# EAGLE design rev_A (EAGLE 7.7.0)
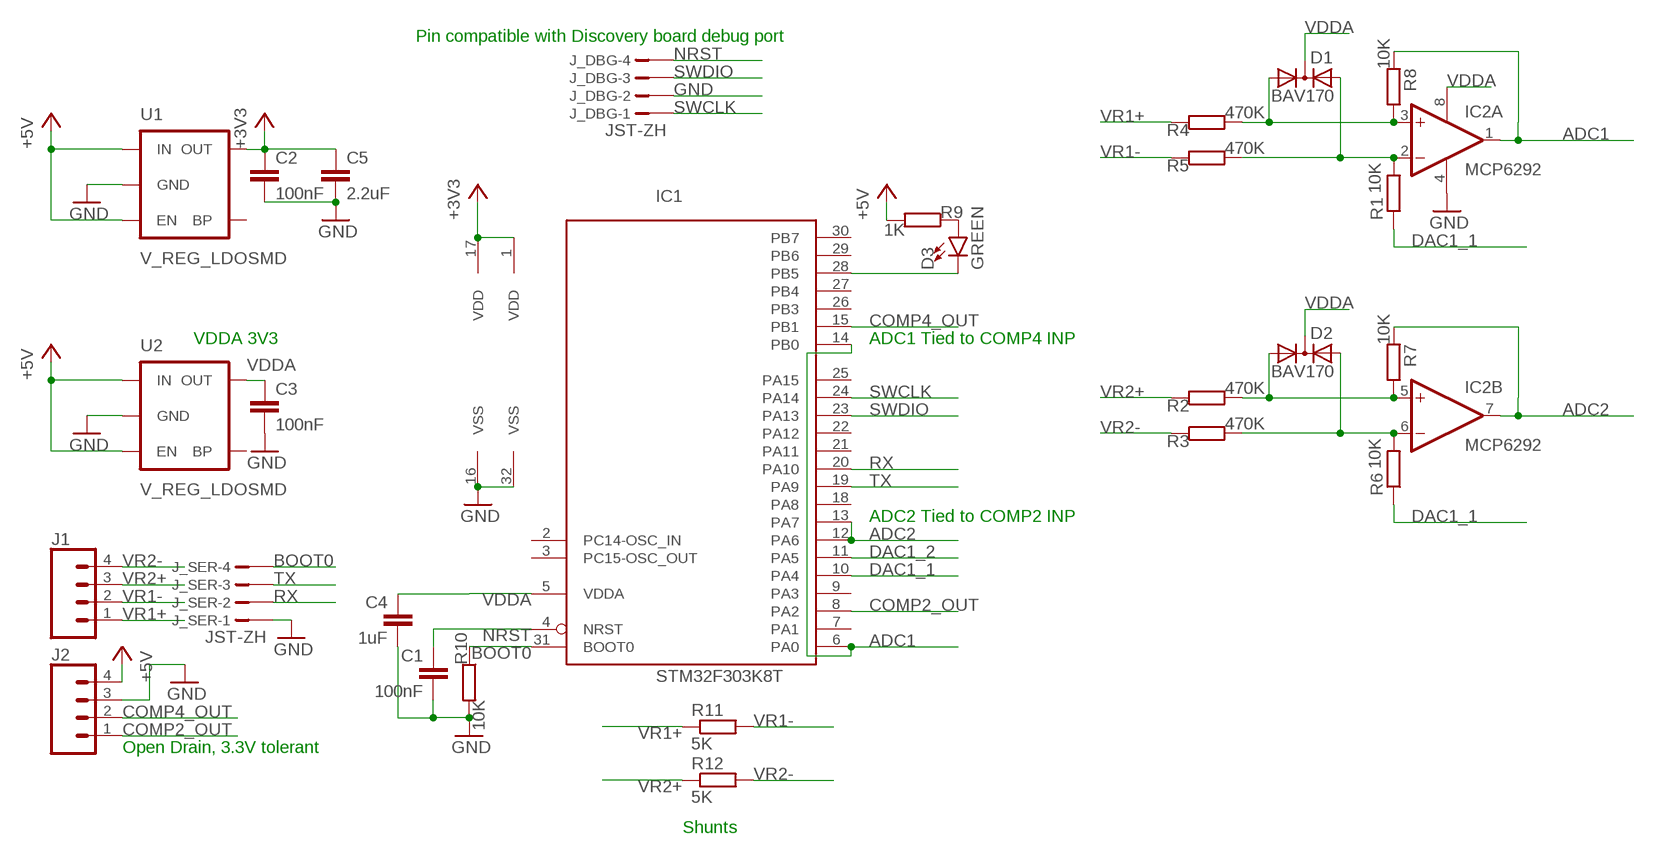
[diagram p0: schematic, sheet 1]

## Parts
C1  100nF  C-EUC0603  [C0603]
C2  100nF  C-EUC0603  [C0603]
C3  100nF  C-EUC0603  [C0603]
C4  1uF  C-EUC0603  [C0603]
C5  2.2uF  C-EUC0603  [C0603]
D1  BAV170  DIODE-2AC|CASOT23  [SOT23]
D2  BAV170  DIODE-2AC|CASOT23  [SOT23]
D3  GREEN  LED-GREEN0603  [LED-0603]
IC1  STM32F303K8T  STM32L051K6T  [LQFP32]
IC2  MCP6292  MCP602SN  [SO08]
J1  CONN_04LOCK  [1X04_LOCK]
J2  CONN_04LOCK  [1X04_LOCK]
J_DBG  JST-ZH  B4B-ZR  [B4B-ZR]
J_SER  JST-ZH  B4B-ZR  [B4B-ZR]
R1  10K  R-EU_R0603  [R0603]
R2  470K  R-EU_R0603  [R0603]
R3  470K  R-EU_R0603  [R0603]
R4  470K  R-EU_R0603  [R0603]
R5  470K  R-EU_R0603  [R0603]
R6  10K  R-EU_R0603  [R0603]
R7  10K  R-EU_R0603  [R0603]
R8  10K  R-EU_R0603  [R0603]
R9  1K  R-EU_R0603  [R0603]
R10  10K  R-EU_R0603  [R0603]
R11  5K  R-EU_0411/12  [0411/12]
R12  5K  R-EU_0411/12  [0411/12]
U1  V_REG_LDOSMD  [SOT23-5]
U2  V_REG_LDOSMD  [SOT23-5]

## Nets
+3V3: C2.1 C5.1 IC1.1(VDD) IC1.17(VDD) U1.5(OUT)
+5V: J2.4 R9.2 U1.1(IN) U1.3(EN) U2.1(IN) U2.3(EN)
ADC1: IC1.6(PA0) IC1.14(PB0) IC2.1(A:OUT) R8.2
ADC2: IC1.12(PA6) IC1.13(PA7) IC2.7(B:OUT) R7.2
BOOT0: IC1.31(BOOT0) J_SER.4 R10.1
COMP2_OUT: IC1.8(PA2) J2.1
COMP4_OUT: IC1.15(PB1) J2.2
DAC1_1: IC1.10(PA4) R1.1 R6.1
DAC1_2: IC1.11(PA5)
GND: C1.2 C2.2 C3.2 C4.2 C5.2 IC1.16(VSS) IC1.32(VSS) IC2.4(P:V-) J2.3 J_DBG.2 J_SER.1 R10.2 U1.2(GND) U2.2(GND)
N$1: D2.1(A1) IC2.5(B:+IN) R2.2 R7.1
N$2: D1.1(A1) IC2.3(A:+IN) R4.2 R8.1
N$4: D3.C IC1.28(PB5)
N$5: D3.A R9.1
NRST: C1.1 IC1.4(NRST) J_DBG.4
PEAK1: D1.2(A2) IC2.2(A:-IN) R1.2 R5.2
PEAK2: D2.2(A2) IC2.6(B:-IN) R3.2 R6.2
RX: IC1.20(PA10) J_SER.2
SWCLK: IC1.24(PA14) J_DBG.1
SWDIO: IC1.23(PA13) J_DBG.3
TX: IC1.19(PA9) J_SER.3
VDDA: C3.1 C4.1 D1.3(C) D2.3(C) IC1.5(VDDA) IC2.8(P:V+) U2.5(OUT)
VR1+: J1.1 R4.1 R11.1
VR1-: J1.2 R5.1 R11.2
VR2+: J1.3 R2.1 R12.1
VR2-: J1.4 R3.1 R12.2
Unconnected: IC1.2(PC14-OSC_IN) IC1.3(PC15-OSC_OUT) IC1.7(PA1) IC1.9(PA3) IC1.18(PA8) IC1.21(PA11) IC1.22(PA12) IC1.25(PA15) IC1.26(PB3) IC1.27(PB4) IC1.29(PB6) IC1.30(PB7) U1.4(BP) U2.4(BP)

## Notes on the sheet
- Pin compatible with Discovery board debug port
- VDDA 3V3 | ADC1 Tied to COMP4 INP
- ADC2 Tied to COMP2 INP
- Open Drain, 3.3V tolerant
- Shunts

## Library data of the parts
C1-C5 = resistor:C-EU: CAPACITOR, European symbol
D1 D2 = diode:DIODE-2AC|CA: Dual DIODE Anode-Cathode|Cathode-Anode
D3 = SparkFun-LED:LED-GREEN: Green SMD LED Used in manufacturing of various products at SparkFun Packages: 0603 - SMD 0603 package [Product Link] <http://www.futureelectronics.com/en/technologies/semiconductors/optoelectronics/leds/Pages/9894312-LTST-C190GKT.aspx?CrossPart=HSMG-C190&IM=0> LilyPad 1206 - SMD1206 LilyPad package [Product Link] <http://www.futureelectronics.com/en/Technologies/Product.aspx?ProductID=IN150NGHARVATEKCORPORATION2049943&IM=0> 1206 - SMD1206 package [Product Link] <http://www.futureelectronics.com/en/technologies/semiconductors/optoelectronics/leds/Pages/8315665-LTST-C150KGKT.aspx?IM=0> 1206 Bottom Mount -SMD 1206 Bottom Mount [Product Link] <http://www.digikey.com/product-detail/en/lite-on-inc/LTST-C230KGKT/160-1456-1-ND/386854> SparkFun Products: Pro Mini 328 -5V <https://www.sparkfun.com/products/821> RedBoard <https://www.sparkfun.com/products/12757> MP3 Trigger <https://www.sparkfun.com/products/13720> Makey Makey <https://www.sparkfun.com/products/11076>; PROD_ID: DIO-00821
IC1 = micro-stm_v2:STM32L051K*T: ARM 32-bit Cortex™-M0+ CPU 32 MHz maximum frequency 32 to 64 Kbytes of Flash memory 2 kbyte of Data EEPROM 8 kbytes of SRAM 27 GPIOs 1.8 to 3.6 V application supply
IC2 = linear:MCP602: Single Op Amp 2.7V to 6.0V Single Supply CMOS Source: http://ww1.microchip.com/downloads/en/DeviceDoc/21314g.pdf
J1 J2 = SparkFun-Connectors:CONN_04: Multi connection point. Often used as Generic Header-pin footprint for 0.1 inch spaced/style header connections On any of the 0.1 inch spaced packages, you can populate with these: Break Away Headers - Straight <https://www.sparkfun.com/products/116> (PRT-00116) Break Away Male Headers - Right Angle <https://www.sparkfun.com/products/553> (PRT-00553) Female Headers <https://www.sparkfun.com/products/115> (PRT-00115) Break Away Headers - Machine Pin <https://www.sparkfun.com/products/117> (PRT-00117) Break Away Female Headers - Swiss Machine Pin <https://www.sparkfun.com/products/743> (PRT-00743) For SCREWTERMINALS and SPRING TERMINALS visit here: Screw Terimnals on SparkFun.com <https://www.sparkfun.com/search/results?term=Screw+Terminals> (5mm/3.5mm/2.54mm spacing) This device is also useful as a general connection point to wire up your design to another part of your project. Our various solder wires solder well into these plated through hole pads. Hook-Up Wire - Assortment (Stranded, 22 AWG) <https://www.sparkfun.com/products/11375> (PRT-11375) Hook-Up Wire - Assortment (Solid Core, 22 AWG) <https://www.sparkfun.com/products/11367> (PRT-11367) View the entire wire category on our website here <https://www.sparkfun.com/categories/141> Special notes: Molex polarized connector foot print use with SKU : PRT-08231 with associated crimp pins and housings. 1MM SMD Version SKU: PRT-10208; PROD_ID: CONN-09696
J_DBG J_SER = con-jst:?4B-ZR: ZH CONNECTOR 1.5 mm, 4 pin 1 row Source: http://www.jst.com .. eZH.pdf; MF: FARNELL; MPN: B4B-ZR(LF)(SN); OC_FARNELL: 1830916; OC_NEWARK: 37K9960
R1-R12 = resistor:R-EU_: RESISTOR, European symbol
U1 U2 = SparkFun:V_REG_LDO: Voltage Regulator LDO Standard 150mA LDO voltage regulator in SOT-23 layout. Micrel part MIC5205. BP (by-pass) pin is used to lower output noise with 470pF cap.

## Board
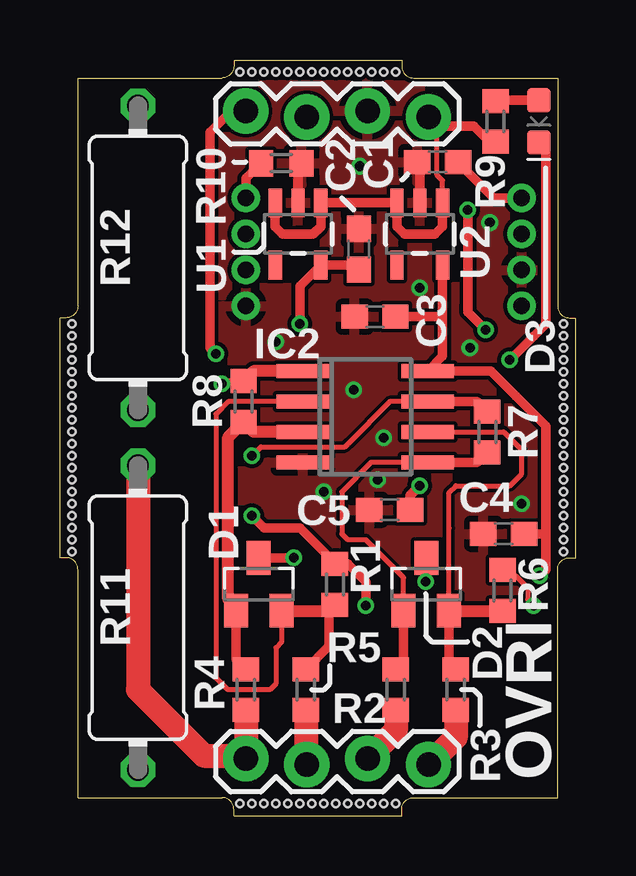
[diagram p1: board, top side]
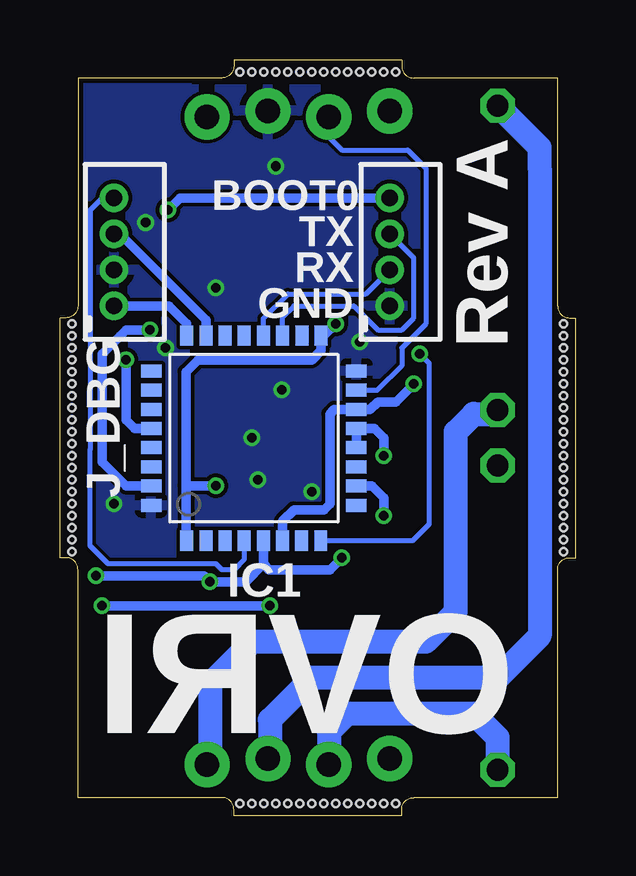
[diagram p2: board, bottom side, seen from below]

Size 21.5 x 31.5 mm. Coordinates in mm from the lower left corner, seen from the top.
Outline: 0.75,0.75 6.75,0.75 arc-90 7.25,0.25 7.25,0 14.25,0 14.25,0.25 arc-90 14.75,0.75 16.5,0.75 20.75,0.75 20.75,10.25 arc-90 21.25,10.75 21.5,10.75 21.5,20.75 21.25,20.75 arc-90 20.75,21.25 20.75,21.5 20.75,30.75 14.75,30.75 arc-90 14.25,31.25 14.25,31.5 7.25,31.5 7.25,31.25 arc-90 6.75,30.75 0.75,30.75 0.75,21.25 arc-90 0.25,20.75 0,20.75 0,10.75 0.25,10.75 arc-90 0.75,10.25 0.75,0.75
Copper layers (1*16): Top 0.035mm / dielectric 1.5mm / Bottom 0.035mm
Design rules "SeeedStudio_2layer_DRU_no_angle_20140221 *": minimum track width 6mil, minimum drill 12mil, track to track 6mil, track to pad 6mil, pad to pad 6mil, via to via 6mil, smd to smd 0mil, copper to edge 8mil, drill to drill 8mil, minimum pad ring 10mil, minimum via ring 6mil, stop-mask expansion 2mil, vias tented up to drill 100mil, thermal gap 10mil
Holes 0.3 mm at 11,31 11.5,31 12,31 12.5,31 13,31 13.5,31 7.5,31 8,31 8.5,31 9,31 11,0.5 11.5,0.5 12,0.5 12.5,0.5 13,0.5 13.5,0.5 14,0.5 0.5,20.5 0.5,20 0.5,19.5 0.5,19 0.5,18.5 0.5,18 0.5,17.5 0.5,17 0.5,16.5 0.5,16 0.5,15.5 0.5,15 0.5,14.5 0.5,14 0.5,13.5 0.5,13 0.5,12.5 0.5,12 0.5,11.5 0.5,11 21,20.5 21,20 21,19.5 21,19 21,18.5 21,18 21,17.5 21,17 21,16.5 21,16 21,15.5 21,15 21,14.5 21,14 21,13.5 21,13 21,12.5 21,12 21,11.5 21,11 10.5,0.5 10,0.5 9.5,0.5 9,0.5 8.5,0.5 8,0.5 7.5,0.5 10.5,31 10,31 9.5,31 14,31
bRestrict: area 5.2,30.5 to 16,31.2

### Footprints (pad centres in the part's own frame; a part is rotated, then mirrored left to right if it is on the bottom)
C0603 = smd 1.1 x 1: 1 -0.85,0; 2 0.85,0
SOT23 = smd 1 x 1.4: 1 -0.95,-1.1; 2 0.95,-1.1; 3 0,1.1
LED-0603 = smd 1 x 1: A -0.877,0; C 0.877,0
LQFP32 = smd 0.54 x 0.85: 1 -2.8,-4.275; 2 -2,-4.275; 3 -1.2,-4.275; 4 -0.4,-4.275; 5 0.4,-4.275; 6 1.19,-4.275; 7 1.99,-4.275; 8 2.79,-4.275; 17 2.8,4.275; 18 2,4.275; 19 1.2,4.275; 20 0.4,4.275; 21 -0.4,4.275; 22 -1.2,4.275; 23 -2,4.275; 24 -2.8,4.275 | smd 0.85 x 0.54: 9 4.275,-2.8; 10 4.275,-2; 11 4.275,-1.2; 12 4.275,-0.4; 13 4.275,0.4; 14 4.275,1.2; 15 4.275,2; 16 4.275,2.8; 25 -4.275,2.8; 26 -4.275,2; 27 -4.275,1.2; 28 -4.275,0.4; 29 -4.275,-0.4; 30 -4.275,-1.2; 31 -4.275,-2; 32 -4.275,-2.8
SO08 = smd 0.6 x 2.2: 1 -1.905,-2.6; 2 -0.635,-2.6; 3 0.635,-2.6; 4 1.905,-2.6; 5 1.905,2.6; 6 0.635,2.6; 7 -0.635,2.6; 8 -1.905,2.6
1X04_LOCK = drill 1.016 pad 1.88: 1 0,0.127; 2 2.54,-0.127; 3 5.08,0.127; 4 7.62,-0.127
B4B-ZR = drill 0.7 pad 1.1: 1 -2.25,0; 2 -0.75,0; 3 0.75,0; 4 2.25,0
R0603 = smd 1 x 1.1: 1 -0.85,0; 2 0.85,0
0411/12 = drill 0.914 octagon: 1 -6.35,0; 2 6.35,0
SOT23-5 = smd 0.55 x 1.2: 1 -0.95,-1.3; 2 0,-1.3; 3 0.95,-1.3; 4 0.95,1.3; 5 -0.95,1.3

### Placement (x,y rotation side)
C1  15.75,27.25 180 top
C2  12.46,23.61 90 top
C3  13.14,20.8 180 top
C4  18.5,11.75 180 top
C5  13.75,12.75 180 top
D1  8.29,9.64 0 top
D2  15.28,9.64 0 top
D3  19.97,28.94 270 top
IC1  13.41,15.73 0 bottom
IC2  12.73,16.62 270 top
J1  7.75,2.25 0 top
J2  7.75,29.25 0 top
J_DBG  19.25,23.5 90 bottom
J_SER  7.75,23.5 90 bottom
R1  11.46,9.64 270 top
R2  14,5.25 90 top
R3  16.5,5.25 90 top
R4  7.75,5.25 90 top
R5  10.25,5.25 90 top
R6  18.45,9.39 270 top
R7  17.82,15.99 90 top
R8  7.66,17.26 90 top
R9  18.16,28.93 270 top
R10  9.23,27.19 0 top
R11  3.25,8.25 270 top
R12  3.25,23.25 270 top
U1  9.93,24.25 180 top
U2  15.01,24.25 180 top

### Tracks (layer width: path | path; a pad name or v marks a point on that pad's centre or on a via)
+3V3  (via drill 0.4)
  Top 0.4: C2.1 12.28,22.95 U1.5 10,22.07 v10,20.5 | C5.1 14.6,13.35 v15,13.75
  Bottom 0.4: v10,20.5 10.49,20.01 IC1.17 10.62,19.39 11,19 15.75,19 16.25,18.5 16.25,13.75 | 16.25,13.75 16.25,11.49 IC1.1 | v15,13.75 16.25,13.75
+5V
  Top 0.2: U2.1 15.96,26.47 15.72,26.7 15.72,28.77 J2.4
  Top 0.4: U2.1 15.96,24.56 15.64,24.25 15.51,24.25 14.37,24.25 14.05,24.56 U2.3 U1.1 10.88,24.56 10.56,24.25 9.93,24.25 9.29,24.25 8.97,24.56 U1.3 | R9.2 17.91,28.09 17.25,28.75 15.74,28.75 15.72,28.77
ADC1  (via drill 0.4)
  Top 0.2: R8.2 6.86,18.11 v6.75,18
  Top 0.5: IC2.1 8.07,18.53 R8.2
  Bottom 0.4: v6.75,18 7.5,17.25 8.25,17.25 8.57,16.93 IC1.14 10.06,16.93 10.25,16.75 10.25,13 10.5,12.75 11.75,12.75 12.22,12.28 IC1.6
ADC2  (via drill 0.4)
  Top 0.2: v8,15 8.25,15.25 8.38,15.38 11.88,15.38 12,15.5 13.76,17.26 IC2.7
  Top 0.4: IC2.7 17.39,17.26 R7.2
  Bottom 0.4: IC1.12 IC1.13 8.38,16.13 8,15.75 v8,15
BOOT0  (via drill 0.4)
  Top 0.4: J_SER.4 7.75,26.57 R10.1 | v17,25.25 17,21.25 17,21 v17.75,20.25
  Bottom 0.4: IC1.31 18.73,13.73 19.75,14.75 19.75,18.75 19.75,19.25 19,20 18.75,20.25 v17.75,20.25 | J_SER.4 16.5,25.75 v17,25.25
COMP2_OUT  (via drill 0.4)
  Top 0.4: v6.5,19.25 6.25,19.5 6.25,28.5 7,29.25 7.62,29.25 J2.1
  Bottom 0.2: IC1.8 6.79,11.46 6.1,12.15 6.1,17.15 6.1,18.85 v6.5,19.25
COMP4_OUT
  Bottom 0.2: J2.2 10.29,28.29 9.75,27.75 7,27.75 6.25,27 6.25,20.5 7.25,19.5 7.25,18.75 8.27,17.73 IC1.15
DAC1_1  (via drill 0.4)
  Top 0.2: 19.5,9 v19.75,8.75 19.5,9 | R1.1 11.46,10.54 | R6.1 18.45,10.05 18.5,10 19,10 19.5,9.5 19.5,9
  Top 0.4: R1.1 12.01,10.49 12.75,9.75 v12.75,8.75 | 11.46,10.54 10,12 8.5,12 v8,12.5
  Bottom 0.2: 9.12,13.75 IC1.10
  Bottom 0.4: v12.75,8.75 16.75,8.75 v19.75,8.75 | v8,12.5 8,13.25 8.5,13.75 9.12,13.75
GND  (via drill 0.4)
  Top 0.4: U2.2 15.01,27.07 C1.2 | U1.2 9.93,26.97 R10.2
  other vias: 12.5,27.07 11,13.5 9,19.75 17.93,24.73 15,22 17.1,19.5 19.25,13 12.25,17.75 13.25,14 13.5,15.75
  pour Bottom: 0.75,30.75 20.75,30.75 20.75,7.5 0.75,7.5
  pour Top: 0.75,30.75 20.75,30.75 20.75,7.5 0.75,7.5
N$1
  Top 0.2: IC2.5 12.97,14.72 11.75,13.5 11.75,11.75 12,11.5 12.75,11.5 14.25,10 14.32,9.93 D2.1
  Top 0.4: IC2.5 17.39,14.72 R7.1 | D2.1 14.32,6.42 R2.2
N$2
  Top 0.4: D1.1 7.34,6.51 R4.2
  Top 0.5: IC2.3 8.07,15.99 R8.1 7.02,15.78 7.02,9.03 7.34,8.71 D1.1
N$4  (via drill 0.4)
  Top 0.4: D3.C 19.72,28.28 20.25,27.75 20.25,20.5 19.75,20 v18.75,19
  Bottom 0.4: IC1.28 18.39,16.13 18.75,16.5 v18.75,19
N$5
  Top 0.4: D3.A 18.19,29.82 R9.1
NRST
  Top 0.4: 16.6,27.17 C1.1 18.1,25.75 J_DBG.4
  Bottom 0.2: IC1.4 13.81,10.69 14.25,10.25 14.75,10.25 15,10.5 19.5,10.5 20.25,11.25 20.25,15.25 20.25,25.25 19.75,25.75 J_DBG.4
PEAK1
  Top 0.2: IC2.2 7.01,17.26 6.5,16.75 6.5,5.75 7,5.25 8.75,5.25 9,5.5 9,7 9.24,7.24 D1.2
  Top 0.4: 11.21,8.54 11.21,7.07 R5.2
  Top 0.5: D1.2 11.21,8.54 R1.2
PEAK2
  Top 0.2: D2.2 16.23,11.97 16.23,13.47 16.5,13.75 18.75,13.75 19.25,14.25 19.25,15 19.25,15.25 18.51,15.99 IC2.6
  Top 0.4: D2.2 16.23,6.38 R3.2
  Top 0.5: D2.2 18.2,8.54 R6.2
RX
  Bottom 0.2: IC1.20 13.02,20.73 12,21.75 8.75,21.75 J_SER.2
SWCLK
  Bottom 0.4: J_DBG.1 16.95,21.25 16.21,20.51 IC1.24
SWDIO
  Bottom 0.4: IC1.23 15.41,20.66 19,24.25 J_DBG.3
TX
  Bottom 0.2: IC1.19 12.21,20.79 11.75,21.25 9.25,21.25 8.25,20.25 7.25,20.25 6.75,20.75 6.75,23.25 J_SER.3
VDDA  (via drill 0.4)
  Top 0.4: U2.5 15.96,20.75 | 15.96,20.75 15.96,19.15 IC2.8 17.97,18.53 19,17.5 20.25,16.25 20.25,11.75 | D2.3 15.28,9.78 v15.25,9.75 | D1.3 v9.74,10.74 v9.75,10.75 | 20.25,11.75 20.25,10.25 v20,10 | C3.1 15.91,20.8 15.96,20.75 | C4.1 20.25,11.75
  Bottom 0.4: IC1.5 13.02,10.48 | 13.02,10.48 13.75,9.75 v15.25,9.75 15.5,10 18.75,10 19,10 19.88,10 v20,10 | v9.75,10.75 10.25,10.25 10.75,10.25 12.78,10.25 13.02,10.48
VR1+
  Top 1: R4.1 J1.1 7.63,2.5 6,2.5 3.25,5.25 R11.1
VR1-
  Top 0.4: 10.29,4.36 R5.1
  Top 1: J1.2 10.29,4.36
  Bottom 1: R11.2 3.25,3.25 4.25,4.25 9.54,4.25 10.29,3.5 J1.2
VR2+
  Top 1: R2.1 14,3.55 J1.3
  Bottom 1: J1.3 12.75,2.46 12.75,4 11,5.75 3.25,5.75 1.5,7.5 1.5,27 1.5,27.85 R12.1
VR2-
  Top 1: R3.1 16.5,3.25 J1.4
  Bottom 1: J1.4 15.25,2.24 15.25,5.5 13.5,7.25 6.25,7.25 5,8.5 5,16 4.25,16.75 3.4,16.75 R12.2

### Text on the board
tPlace: OVRI
bPlace: Rev A | BOOT0 | TX | RX | GND | OVRI